# EasyEDA schematic stm32_1.json
TITLE: -1代平衡步兵控制器; REV: 1.0; Date: 2022-09-18; Sheet: 1/1; Drawn By: JagerLikesToFly; Company: cxj
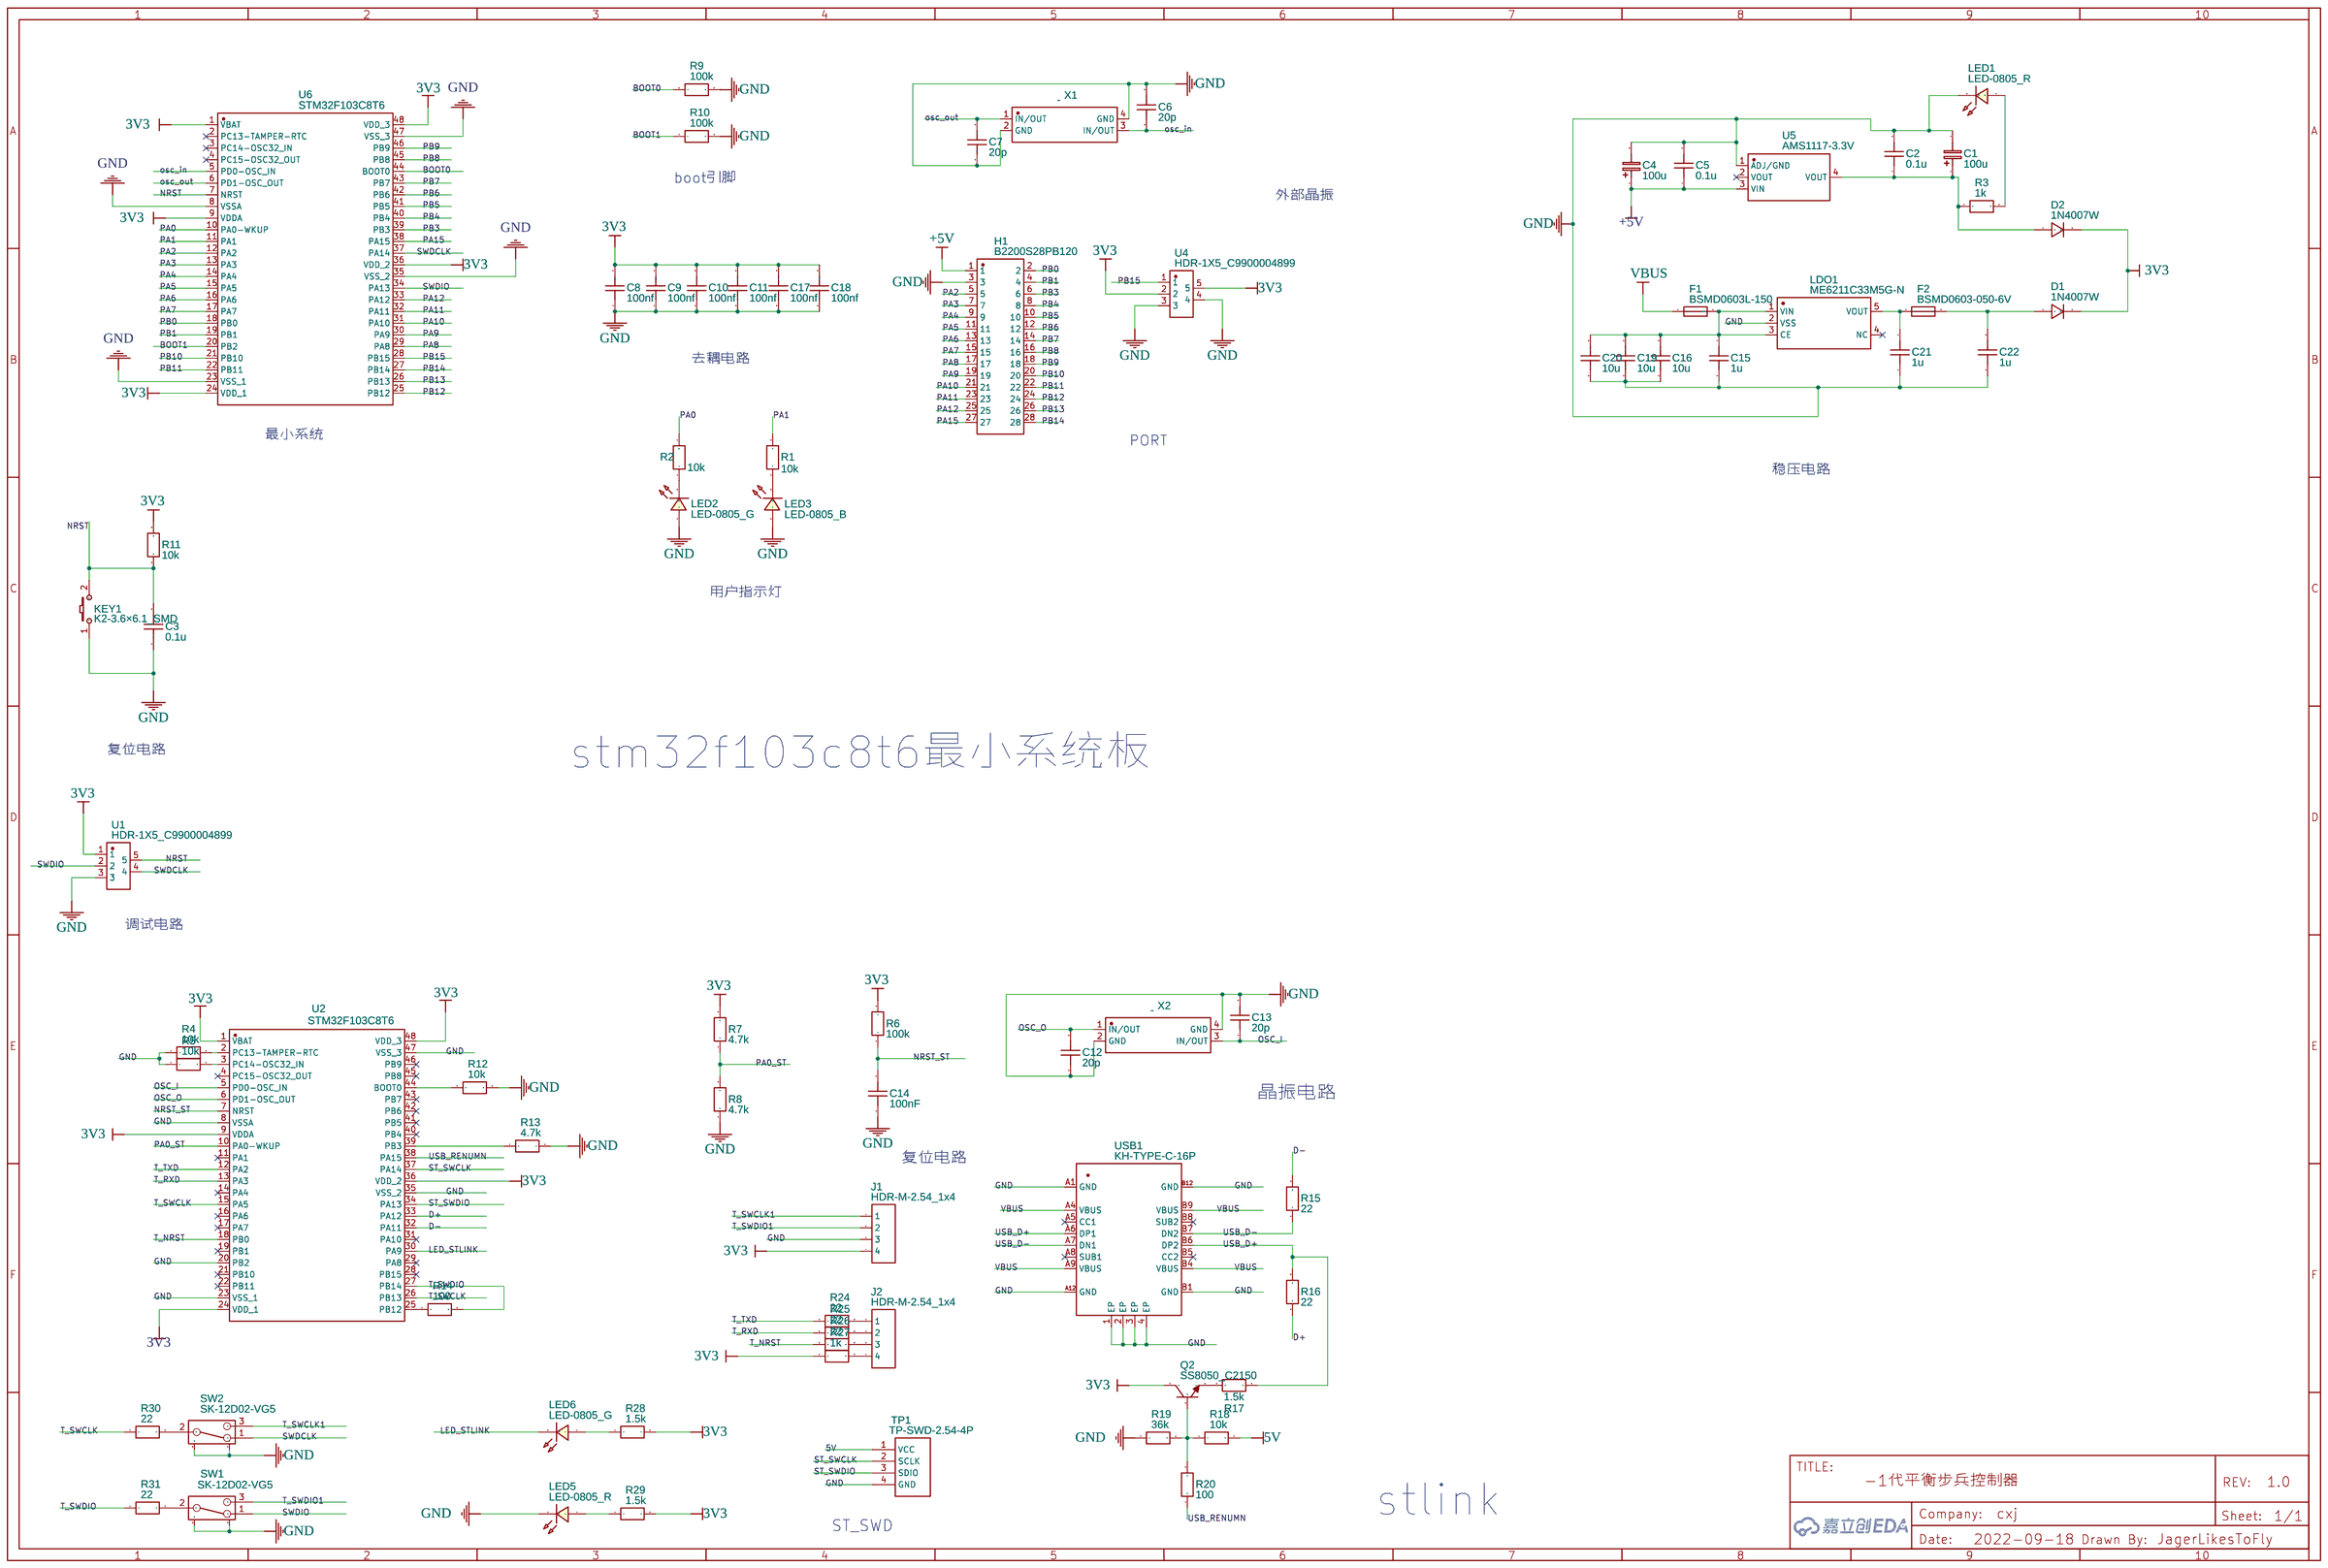
[diagram p0: schematic sheet]

## Parts
C1  100u  [CASE-A_3216]
C2  0.1u  [C0805]
C3  0.1u  [C0805]
C4  100u  [CASE-A_3216]
C5  0.1u  [C0805]
C6  20p  [C0805]
C7  20p  [C0805]
C8  100nf  [C0805]
C9  100nf  [C0805]
C10  100nf  [C0805]
C11  100nf  [C0805]
C12  20p  [C0805]
C13  20p  [C0805]
C14  100nF  [C0805]
C15  1u  [C0805]
C16  10u  [C0805]
C17  100nf  [C0805]
C18  100nf  [C0805]
C19  10u  [C0805]
C20  10u  [C0805]
C21  1u  [C0805]
C22  1u  [C0805]
D1  1N4007W  [SOD-123_L2.8-W1.8-LS3.7-RD]
D2  1N4007W  [SOD-123_L2.8-W1.8-LS3.7-RD]
F1  BSMD0603L-150  [F0603]
F2  BSMD0603-050-6V  [F0603]
H1  B2200S28PB120  [HDR-TH_28P-P2.54-V-F-R2-C14-S2.54-1]
J1  HDR-M-2.54_1x4  [HDR-M-2.54_1X4]
J2  HDR-M-2.54_1x4  [HDR-M-2.54_1X4]
KEY1  K2-3.6×6.1_SMD  [KEY-SMD_2P-L6.2-W3.6-LS8.0]
LDO1  ME6211C33M5G-N  [SOT-23-5_L3.0-W1.7-P0.95-LS2.8-BR]
LED1  LED-0805_R  [LED0805_RED]
LED2  LED-0805_G  [LED0805_GREEN]
LED3  LED-0805_B  [LED0805_BLUE]
LED5  LED-0805_R  [LED0805_RED]
LED6  LED-0805_G  [LED0805_GREEN]
Q2  SS8050_C2150  [SOT-23-3_L2.9-W1.3-P1.90-LS2.4-BR]
R1  10k  [R0805]
R2  10k  [R0805]
R3  1k  [R0805]
R4  10k  [R0805]
R5  10k  [R0805]
R6  100k  [R0805]
R7  4.7k  [R0805]
R8  4.7k  [R0805]
R9  100k  [R0805]
R10  100k  [R0805]
R11  10k  [R0805]
R12  10k  [R0805]
R13  4.7k  [R0805]
R14  100  [R0805]
R15  22  [R0805]
R16  22  [R0805]
R17  1.5k  [R0805]
R18  10k  [R0805]
R19  36k  [R0805]
R20  100  [R0805]
R24  22  [R0805]
R25  22  [R0805]
R26  22  [R0805]
R27  1k  [R0805]
R28  1.5k  [R0805]
R29  1.5k  [R0805]
R30  22  [R0805]
R31  22  [R0805]
SW1  SK-12D02-VG5  [SW-TH_SK-12D02VG3]
SW2  SK-12D02-VG5  [SW-TH_SK-12D02VG3]
TP1  TP-SWD-2.54-4P  [TP-2.54-4P]
U1  HDR-1X5_C9900004899  [CONN-TH_5P-P2.50_HDR-1X5]
U2  STM32F103C8T6  [LQFP-48_L7.0-W7.0-P0.50-LS9.0-BL]
U4  HDR-1X5_C9900004899  [CONN-TH_5P-P2.50_HDR-1X5]
U5  AMS1117-3.3V  [SOT-223-4_L6.5-W3.5-P2.30-LS7.0-BR]
U6  STM32F103C8T6  [LQFP-48_L7.0-W7.0-P0.50-LS9.0-BL]
USB1  KH-TYPE-C-16P  [USB-C-SMD_KH-TYPE-C-16P]
X1  -  [CRYSTAL-SM_4P-L2.0-W1.6-BL_ABM11AIG27000MH]
X2  -  [CRYSTAL-SM_4P-L2.0-W1.6-BL_ABM11AIG27000MH]

## Library data of the parts
C1 C4 = C_Tan_SMD_A_EU: Contributor: LCEDA_Lib
C2 C5-C7 C12-C16 C19-C22 = C_0805_US: Contributor: LCEDA_Lib
C3 C8-C11 C17 C18 = C_0603_US: Contributor: LCEDA_Lib
D1 D2 = 1N4007W: Supplier: LCSC; Supplier Part: C328592; Manufacturer: BLUE ROCKET; Contributor: LCEDA_Lib
F1 = BSMD0603L-150: Supplier: LCSC; Supplier Part: C914094; Manufacturer: BHFUSE; Contributor: LCSC; JLCPCB Part Class: Extended Part
F2 = BSMD0603-050-6V: Supplier: LCSC; Supplier Part: C883095; Manufacturer: BHFUSE; Contributor: LCSC; JLCPCB Part Class: Extended Part
H1 = B2200S28PB120: Supplier: LCSC; Supplier Part: C379815; Manufacturer: Shenzhen Cankemeng; Contributor: LCSC; JLCPCB Part Class: Extended Part
J1 J2 = HDR-M-2.54_1x4: Supplier Part: C124378; Supplier: LCSC; Contributor: Greysin2021
KEY1 = K2-3.6×6.1_SMD: Supplier Part: C118141; Supplier: LCSC; Manufacturer Part: K2-1107ST-A4SW-06; Contributor: LCEDA_Lib; 制造商: 韩国韩荣
LDO1 = ME6211C33M5G-N: Supplier: LCSC; Manufacturer: MICRONE; Supplier Part: C82942; JLCPCB Part Class: Extended Part
LED1 = LED-0603_R: Manufacturer: EVERLIGHT(台湾亿光); Manufacturer Part: 19-217/R6C-AL1M2VY/3T; Supplier Part: C72044; Supplier: LCSC; Contributor: LCEDA_01
LED2 LED6 = LED-0805_G: Manufacturer: 国星光电; Manufacturer Part: NCD0805G1; Supplier Part: C84260; Contributor: LCEDA_Lib
LED3 = LED-0805_B: Manufacturer: 方舟 ARKLED; Manufacturer Part: D-B080508B1-KS2; Supplier Part: C108412; Contributor: LCEDA_Lib
LED5 = LED-0805_R: Manufacturer: EVERLIGHT(台湾亿光); Manufacturer Part: 17-21SURC/S530-A3/TR8; Supplier Part: C72037; Contributor: LCEDA_Lib
Q2 = SS8050_C2150: Supplier: LCSC; Manufacturer: CJ; Manufacturer Part: SS8050; Supplier Part: C2150; JLCPCB Part Class: Basic Part
R1-R8 R12-R20 R24-R31 = R_0805_EU: Contributor: LCEDA_Lib
R9-R11 = R_0603_EU: Contributor: LCEDA_Lib
SW1 SW2 = SK-12D02-VG5: Supplier: LCSC; Supplier Part: C136722; Manufacturer: Rectangular Connectors - Contacts; Contributor: LCSC
TP1 = TP-SWD-2.54-4P: Contributor: crystalpaper
U1 U4 = HDR-1X5_C9900004899: Supplier: LCSC; Supplier Part: C9900004899; Manufacturer: null; Manufacturer Part: HDR-1X5; link: https://atta.szlcsc.comnull; JLCPCB Part Class: Extended Part; Contributor: lcsc
U2 U6 = STM32F103C8T6: Supplier: LCSC; Manufacturer: STMicroelectronics; Supplier Part: C8734; JLCPCB Part Class: Basic Part
U5 = AMS1117-3.3V: Supplier: LCSC; Supplier Part: C2688239; Manufacturer: WPMtek(维攀微); Contributor: LCSC; JLCPCB Part Class: Extended Part
USB1 = KH-TYPE-C-16P: Supplier: LCSC; Supplier Part: C709357; Manufacturer: Shenzhen Kinghelm Elec; Contributor: LCSC; JLCPCB Part Class: Extended Part
X1 X2 = TZ1897B: Supplier: LCSC; Supplier Part: C337647; Manufacturer: TST; Contributor: LCSC; JLCPCB Part Class: Extended Part

## Nets
3V3: C8.2 C9.2 C10.2 C11.2 C17.2 C18.2 D1.1 D2.1 J1.4 Q2.3(C) R6.2 R7.2 R11.2 R27.1 R28.2 R29.2 U1.1 U2.1(VBAT) U2.9(VDDA) U2.24(VDD_1) U2.36(VDD_2) U2.48(VDD_3) U4.2 U4.5 U6.1(VBAT) U6.9(VDDA) U6.24(VDD_1) U6.36(VDD_2) U6.48(VDD_3)
5V: R18.2 TP1.1(VCC)
+5V: C4.1 C5.1 H1.1 U5.3(VIN)
GND: C1.2 C2.2 C3.1 C4.2 C5.2 C6.2 C7.1 C8.1 C9.1 C10.1 C11.1 C12.1 C13.2 C14.1 C15.2 C16.1 C17.1 C18.1 C19.1 C20.1 C21.1 C22.1 H1.3 J1.3 KEY1.1 LDO1.2(VSS) LED1.2 LED2.1 LED3.1 LED5.2 R4.1 R5.1 R8.1 R9.2 R10.2 R12.2 R13.2 R19.1 SW1.4 SW1.5 SW2.4 SW2.5 TP1.4(GND) U1.3 U2.8(VSSA) U2.20(PB2) U2.23(VSS_1) U2.35(VSS_2) U2.47(VSS_3) U4.3 U4.4 U5.1(ADJ/GND) U6.8(VSSA) U6.23(VSS_1) U6.35(VSS_2) U6.47(VSS_3) USB1.1(EP) USB1.2(EP) USB1.3(EP) USB1.4(EP) USB1.A1(GND) USB1.A12(GND) USB1.B1(GND) USB1.B12(GND) X1.2(GND) X1.4(GND) X2.2(GND) X2.4(GND)
VBUS: F1.1 USB1.A4(VBUS) USB1.A9(VBUS) USB1.B4(VBUS) USB1.B9(VBUS)
BOOT0: R9.1 U6.44(BOOT0)
BOOT1: R10.1 U6.20(PB2)
D+: R16.1 U2.33(PA12)
D-: R15.2 U2.32(PA11)
LED_STLINK: LED6.2 U2.30(PA9)
NRST: C3.2 KEY1.2 R11.1 U1.5 U6.7(NRST)
NRST_ST: C14.2 R6.1 U2.7(NRST)
OSC_I: C13.1 U2.5(PD0-OSC_IN) X2.3(IN/OUT)
osc_in: C6.1 U6.5(PD0-OSC_IN) X1.3(IN/OUT)
OSC_O: C12.2 U2.6(PD1-OSC_OUT) X2.1(IN/OUT)
osc_out: C7.2 U6.6(PD1-OSC_OUT) X1.1(IN/OUT)
PA0: R2.2 U6.10(PA0-WKUP)
PA0_ST: R7.1 R8.2 U2.10(PA0-WKUP)
PA1: R1.2 U6.11(PA1)
PA2: H1.5 U6.12(PA2)
PA3: H1.7 U6.13(PA3)
PA4: H1.9 U6.14(PA4)
PA5: H1.11 U6.15(PA5)
PA6: H1.13 U6.16(PA6)
PA7: H1.15 U6.17(PA7)
PA8: H1.17 U6.29(PA8)
PA9: H1.19 U6.30(PA9)
PA10: H1.21 U6.31(PA10)
PA11: H1.23 U6.32(PA11)
PA12: H1.25 U6.33(PA12)
PA15: H1.27 U6.38(PA15)
PB0: H1.2 U6.18(PB0)
PB1: H1.4 U6.19(PB1)
PB3: H1.6 U6.39(PB3)
PB4: H1.8 U6.40(PB4)
PB5: H1.10 U6.41(PB5)
PB6: H1.12 U6.42(PB6)
PB7: H1.14 U6.43(PB7)
PB8: H1.16 U6.45(PB8)
PB9: H1.18 U6.46(PB9)
PB10: H1.20 U6.21(PB10)
PB11: H1.22 U6.22(PB11)
PB12: H1.24 U6.25(PB12)
PB13: H1.26 U6.26(PB13)
PB14: H1.28 U6.27(PB14)
PB15: U4.1 U6.28(PB15)
ST_SWCLK: TP1.2(SCLK) U2.37(PA14)
ST_SWDIO: TP1.3(SDIO) U2.34(PA13)
SWDCLK: SW2.1 U1.4 U6.37(PA14)
SWDIO: SW1.1 U1.2 U6.34(PA13)
T_NRST: R26.1 U2.18(PB0)
T_RXD: R25.1 U2.13(PA3)
T_SWCLK: R30.1 U2.15(PA5) U2.26(PB13)
T_SWCLK1: J1.1 SW2.3
T_SWDIO: R14.2 R31.1 U2.27(PB14)
T_SWDIO1: J1.2 SW1.3
T_TXD: R24.1 U2.12(PA2)
USB_D+: R16.2 R17.2 USB1.A6(DP1) USB1.B6(DP2)
USB_D-: R15.1 USB1.A7(DN1) USB1.B7(DN2)
USB_RENUMN: R20.1 U2.38(PA15)
Net-(C1-1): C1.1 C2.1 D2.2 R3.1 U5.4(VOUT)
Net-(C15-1): C15.1 C16.2 C19.2 C20.2 F1.2 LDO1.1(VIN) LDO1.3(CE)
Net-(C21-2): C21.2 F2.1 LDO1.5(VOUT)
Net-(C22-2): C22.2 D1.2 F2.2
Net-(J2-1): J2.1 R24.2
Net-(J2-2): J2.2 R25.2
Net-(J2-3): J2.3 R26.2
Net-(J2-4): J2.4 R27.2
Net-(LED1-1): LED1.1 R3.2
Net-(LED2-2): LED2.2 R2.1
Net-(LED3-2): LED3.2 R1.1
Net-(LED5-1): LED5.1 R29.1
Net-(LED6-1): LED6.1 R28.1
Net-(Q2-1): Q2.1(B) R18.1 R19.2 R20.2
Net-(Q2-2): Q2.2(E) R17.1
Net-(R4-2): R4.2 U2.2(PC13-TAMPER-RTC)
Net-(R5-2): R5.2 U2.3(PC14-OSC32_IN)
Net-(R12-1): R12.1 U2.44(BOOT0)
Net-(R13-1): R13.1 U2.39(PB3)
Net-(R14-1): R14.1 U2.25(PB12)
Net-(R30-2): R30.2 SW2.2
Net-(R31-2): R31.2 SW1.2

Not connected (* = marked no-connect by the designer): LDO1 4(NC)*; U2 4(PC15-OSC32_OUT)* 11(PA1)* 14(PA4)* 16(PA6)* 17(PA7)* 19(PB1)* 21(PB10)* 22(PB11)* 28(PB15)* 29(PA8)* 31(PA10)* 40(PB4)* 41(PB5)* 42(PB6)* 43(PB7)* 45(PB8)* 46(PB9)*; U5 2(VOUT)*; U6 2(PC13-TAMPER-RTC)* 3(PC14-OSC32_IN)* 4(PC15-OSC32_OUT)*; USB1 A5(CC1)* A8(SUB1)* B5(CC2)* B8(SUB2)*

## Notes on the sheet
- boot引脚
- 外部晶振
- 去耦电路
- 最小系统
- PORT
- 稳压电路
- 用户指示灯
- 复位电路
- stm32f103c8t6最小系统板
- 调试电路
- 晶振电路
- 复位电路
- stlink
- ST_SWD
